# Altium project Pocket Device.PrjPcb
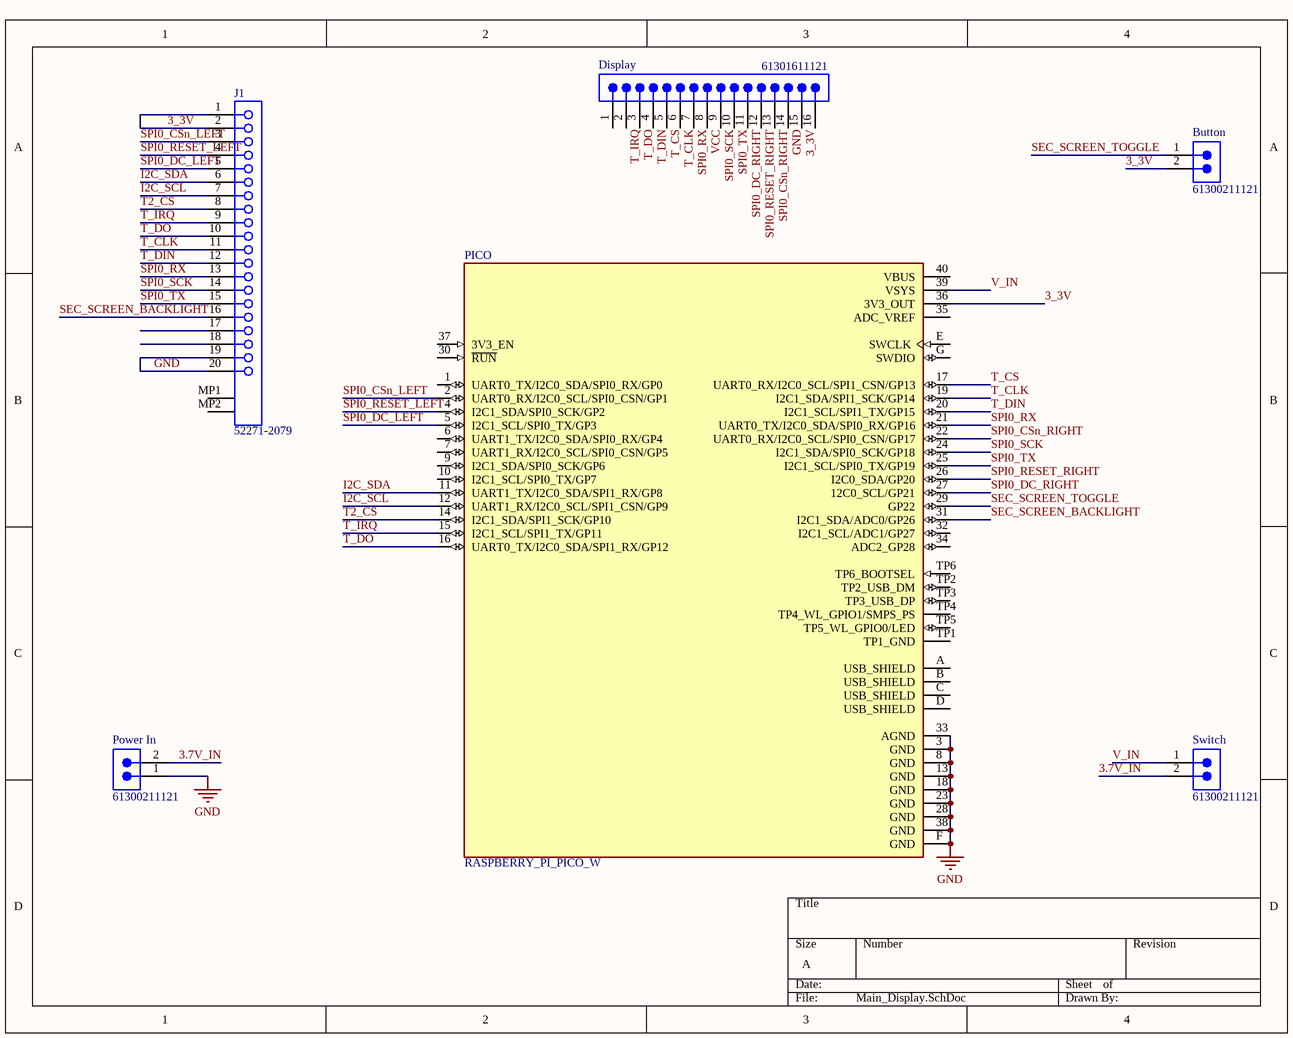
[diagram p0: Main_Display.SchDoc]
2 sheets, 10 parts. Net scope: global (net labels, ports and power ports of the same name join across sheets).
Board files: Pocket Device.PcbDoc, Secondary Display.PcbDoc
Sheets:
  Main_Display.SchDoc
  Secondary_Display.SchDoc

## Sheet Main_Display.SchDoc
size A; SheetNumber: 1; SheetTotal: 2

### Parts
Button  61300211121  [61300211121]
Display  61301611121  [61301611121]
J1  52271-2079  [MOLX-52271-2079]
PICO  RASPBERRY_PI_PICO_W  [MODULE_RASPBERRY_PI_PICO_W]
Power_In  61300211121  [61300211121]
Switch  61300211121  [61300211121]

### Nets
GND: Display.14 J1.19 J1.20 PICO.3(GND) PICO.8(GND) PICO.13(GND) PICO.18(GND) PICO.23(GND) PICO.28(GND) PICO.33(AGND) PICO.38(GND) PICO.F(GND) Power_In.1
3.7V_IN: Power_In.2 Switch.2
3_3V: Button.2 Display.15 J1.1 J1.2 PICO.36(3V3_OUT)
I2C_SCL: J1.7 PICO.12(UART1_RX/I2C0_SCL/SPI1_CSN/GP9)
I2C_SDA: J1.6 PICO.11(UART1_TX/I2C0_SDA/SPI1_RX/GP8)
SEC_SCREEN_BACKLIGHT: J1.16 PICO.31(I2C1_SDA/ADC0/GP26)
SEC_SCREEN_TOGGLE: Button.1 PICO.29(GP22)
SPI0_CSn_LEFT: J1.3 PICO.2(UART0_RX/I2C0_SCL/SPI0_CSN/GP1)
SPI0_CSn_RIGHT: Display.13 PICO.22(UART0_RX/I2C0_SCL/SPI0_CSN/GP17)
SPI0_DC_LEFT: J1.5 PICO.5(I2C1_SCL/SPI0_TX/GP3)
SPI0_DC_RIGHT: Display.11 PICO.27(12C0_SCL/GP21)
SPI0_RESET_LEFT: J1.4 PICO.4(I2C1_SDA/SPI0_SCK/GP2)
SPI0_RESET_RIGHT: Display.12 PICO.26(I2C0_SDA/GP20)
SPI0_RX: Display.7 J1.13 PICO.21(UART0_TX/I2C0_SDA/SPI0_RX/GP16)
SPI0_SCK: Display.9 J1.14 PICO.24(I2C1_SDA/SPI0_SCK/GP18)
SPI0_TX: Display.10 J1.15 PICO.25(I2C1_SCL/SPI0_TX/GP19)
T2_CS: J1.8 PICO.14(I2C1_SDA/SPI1_SCK/GP10)
T_CLK: Display.6 J1.11 PICO.19(I2C1_SDA/SPI1_SCK/GP14)
T_CS: Display.5 PICO.17(UART0_RX/I2C0_SCL/SPI1_CSN/GP13)
T_DIN: Display.4 J1.12 PICO.20(I2C1_SCL/SPI1_TX/GP15)
T_DO: Display.3 J1.10 PICO.16(UART0_TX/I2C0_SDA/SPI1_RX/GP12)
T_IRQ: Display.2 J1.9 PICO.15(I2C1_SCL/SPI1_TX/GP11)
V_IN: PICO.39(VSYS) Switch.1
VCC: Display.8

Not connected (* = marked no-connect by the designer): Display 1 16; J1 17 18 MP1 MP2; PICO 1(UART0_TX/I2C0_SDA/SPI0_RX/GP0) 6(UART1_TX/I2C0_SDA/SPI0_RX/GP4) 7(UART1_RX/I2C0_SCL/SPI0_CSN/GP5) 9(I2C1_SDA/SPI0_SCK/GP6) 10(I2C1_SCL/SPI0_TX/GP7) 30(~{RUN}) 32(I2C1_SCL/ADC1/GP27) 34(ADC2_GP28) 35(ADC_VREF) 37(3V3_EN) 40(VBUS) A(USB_SHIELD) B(USB_SHIELD) C(USB_SHIELD) D(USB_SHIELD) E(SWCLK) G(SWDIO) TP1(TP1_GND) TP2(TP2_USB_DM) TP3(TP3_USB_DP) TP4(TP4_WL_GPIO1/SMPS_PS) TP5(TP5_WL_GPIO0/LED) TP6(TP6_BOOTSEL)

### Library data of the parts
Button Power_In Switch = CMP-1712-00002-6: NexarPartId: 20081794; Number of Contacts: 2; Pitch: 2.54mm; Connector Type: Male Pin; Voltage Rating: 250V; Current Rating: 3A; Gender: Male; Contact Resistance: 20mΩ; Height: 8.94mm; Lead Free: Lead Free; Number of Pins: 2; Termination: Through Hole; RoHS: Compliant; Lead Pitch: 2.54mm; REACH SVHC: No SVHC; Housing Material: PBT; Contact Mating Length: 5.9944mm; Min Operating Temperature: -40°C; Orientation: Vertical; Contact Material: Copper; Contact Gender: Male; Max Operating Temperature: 125°C; Number of Rows: 1; Number of Positions: 2; Packaging: Bulk; Contact Plating: Gold; Mount: Through Hole; Color: Black; Operating Supply Voltage: 250V
Display = CMP-1502-01095-4: NexarPartId: 32855548; Voltage Rating: 250V; Connector Type: Male Pin; Current Rating: 3A; Contact Resistance: 20mΩ; Number of Contacts: 16; Gender: Male; Pitch: 2.54mm; Min Operating Temperature: -40°C; Termination: Solder; Height: 8.89mm; Contact Plating: Gold; Packaging: Bulk; Contact Material: Copper; Mount: Through Hole; Number of Rows: 1; Contact Mating Length: 5.9944mm; Operating Supply Voltage: 250V; RoHS: Compliant; Max Operating Temperature: 105°C; Lead Pitch: 2.54mm; Color: Black; Number of Pins: 16; Number of Positions: 16; REACH SVHC: Unknown; Orientation: Vertical
J1 = CMP-1241-00254-1: 1.0 mm Pitch Easy-On(TM) Type FPC Connector, 3.0 mm Mated Height, Right Angle, ZIF, SMT, Bottom Contact, 20 Circuits, -40 to 85 degC, ELV and RoHS Compliant, Tape and Reel; Manufacturer: Molex; Material - Metal: Phosphor Bronze; Voltage (Max): 50V AC (RMS)/DC; PCB Retention: Yes; Pitch - Termination Interface: 1.00mm; Mated Height: 3.00mm; Circuits (Loaded): 20; Stackable: No; Material - Plating Mating: Tin-Bismuth; Current (Max per Contact): 0.5A; Entry Angle: 90degrees Angle; Durability (mating cycles max): 30; Contact Position: Bottom; ComponentLink1URL: http://www.molex.com/molex/index.jsp; Packing: Tape and Reel; ComponentLink2URL: http://www.molex.com/webdocs/datasheets/pdf/en-us/0522712079_FFC_FPC_CONNECTORS.pdf; PackageVersion: Rev. B, 04/2004; ComponentLink3Description: Package Specification; ComponentLink3URL: http://www.molex.com/pdm_docs/sd/522712079_sd.pdf; Number of Rows: 1; PartNumber: 52271-2079; ComponentLink2Description: Datasheet; PackageDescription: 20-Lead FPC Connector, Pitch 1.0 mm; Mounting Technology: Surface Mount; Polarized to PCB: Yes; PackageReference: 52271-2079; Pitch - Mating Interface: 1.00mm; ComponentLink1Description: Manufacturer URL; Orientation: Right Angle; RoHS: TRUE; PCB Locator: No; Material - Plating Termination: Tin-Bismuth
PICO = RASPBERRY_PI_PICO_W: Raspberry Pi Board, Arm Cortex-M0+; Silicon Manufacturer:Raspberry Pi; No. Of Bits:32Bit; Silicon Family Name:-; Core Architecture:Arm; Core Sub-Architecture:Cortex-M0+; Silicon Core Number:Rp2040; Product Range:Raspberry Pi Pico Rohs Compliant: Yes |Raspberry-Pi RASPBERRY PI PICO W; SnapEDA_Link: https://www.snapeda.com/parts/RASPBERRY%20PI%20PICO%20W/Raspberry+Pi/view-part/?ref=snap; Package: None; Value: *; MF: Raspberry Pi; MP: RASPBERRY PI PICO W; Check_prices: https://www.snapeda.com/parts/RASPBERRY%20PI%20PICO%20W/Raspberry+Pi/view-part/?ref=eda

## Sheet Secondary_Display.SchDoc
size A; SheetNumber: 2; SheetTotal: 2
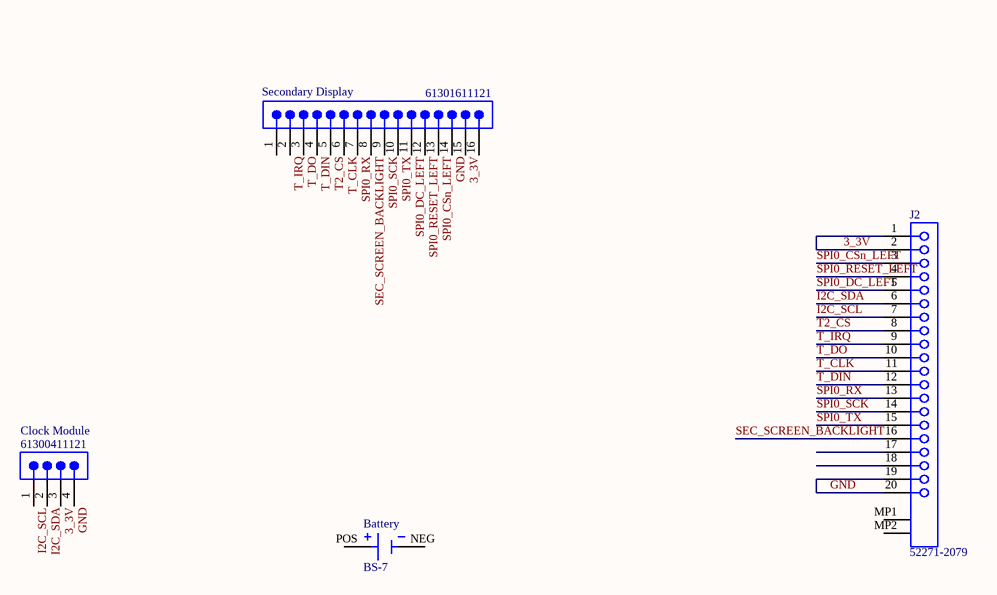
[diagram p1: Secondary_Display.SchDoc]

### Parts
Battery  BS-7  [BAT_BS-7]
Clock_Module  61300411121  [61300411121]
J2  52271-2079  [MOLX-52271-2079]
Secondary_Display  61301611121  [61301611121]

### Nets
GND: Clock_Module.4 J2.19 J2.20 Secondary_Display.14
3_3V: Clock_Module.3 J2.1 J2.2 Secondary_Display.15
I2C_SCL: Clock_Module.1 J2.7
I2C_SDA: Clock_Module.2 J2.6
SEC_SCREEN_BACKLIGHT: J2.16 Secondary_Display.8
SPI0_CSn_LEFT: J2.3 Secondary_Display.13
SPI0_DC_LEFT: J2.5 Secondary_Display.11
SPI0_RESET_LEFT: J2.4 Secondary_Display.12
SPI0_RX: J2.13 Secondary_Display.7
SPI0_SCK: J2.14 Secondary_Display.9
SPI0_TX: J2.15 Secondary_Display.10
T2_CS: J2.8 Secondary_Display.5
T_CLK: J2.11 Secondary_Display.6
T_DIN: J2.12 Secondary_Display.4
T_DO: J2.10 Secondary_Display.3
T_IRQ: J2.9 Secondary_Display.2

Not connected (* = marked no-connect by the designer): Battery NEG POS; J2 17 18 MP1 MP2; Secondary_Display 1 16

### Library data of the parts
Battery = BS-7: Battery Holder (Open) Coin, 20.0mm 1 Cell PC Pin; MF: MPD (Memory; SnapEDA_Link: https://www.snapeda.com/parts/BS-7/MPD+%2528Memory+Protection+Devices%2529/view-part/?ref=snap; Package: None; MP: BS-7; Check_prices: https://www.snapeda.com/parts/BS-7/MPD+%2528Memory+Protection+Devices%2529/view-part/?ref=eda; Purchase-URL: https://pricing.snapeda.com/search/part/BS-7/?ref=eda; Digi-Key_Part_Number: BS-7-ND; Value: *; ComponentLink1Description: https://www.digikey.com/en/products/detail/mpd-memory-protection-devices/BS-7/389447; ComponentLink1URL: *
Clock_Module = CMP-1502-01064-3: NexarPartId: 32855522; Operating Supply Voltage: 250V; Pitch: 2.54mm; Contact Resistance: 20mΩ; Number of Positions: 4; Current Rating: 3A; Connector Type: Male Pin; Gender: Male; Contact Plating: Gold; Height: 8.89mm; Lead Pitch: 2.54mm; Lead Free: Lead Free; Contact Mating Length: 5.9944mm; Number of Rows: 1; Termination: Solder; Packaging: Bulk; REACH SVHC: Unknown; Min Operating Temperature: -40°C; RoHS: Compliant; Number of Contacts: 4; Voltage Rating: 250V; Color: Black; Max Operating Temperature: 105°C; Contact Material: Copper; Mount: Through Hole; Orientation: Vertical; Number of Pins: 4
J2 = CMP-1241-00254-1: as J1 on sheet Main_Display; Contact Position: Bottom; ComponentLink1URL: http://www.molex.com/molex/index.jsp; Packing: Tape and Reel; ComponentLink2URL: http://www.molex.com/webdocs/datasheets/pdf/en-us/0522712079_FFC_FPC_CONNECTORS.pdf; PackageVersion: Rev. B, 04/2004; ComponentLink3Description: Package Specification; ComponentLink3URL: http://www.molex.com/pdm_docs/sd/522712079_sd.pdf; Number of Rows: 1; PartNumber: 52271-2079; ComponentLink2Description: Datasheet; PackageDescription: 20-Lead FPC Connector, Pitch 1.0 mm; Mounting Technology: Surface Mount; Polarized to PCB: Yes; PackageReference: 52271-2079; Pitch - Mating Interface: 1.00mm; ComponentLink1Description: Manufacturer URL; Orientation: Right Angle; RoHS: TRUE; PCB Locator: No; Material - Plating Termination: Tin-Bismuth
Secondary_Display = CMP-1502-01095-4: as Display on sheet Main_Display; Min Operating Temperature: -40°C; Termination: Solder; Height: 8.89mm; Contact Plating: Gold; Packaging: Bulk; Contact Material: Copper; Mount: Through Hole; Number of Rows: 1; Contact Mating Length: 5.9944mm; Operating Supply Voltage: 250V; RoHS: Compliant; Max Operating Temperature: 105°C; Lead Pitch: 2.54mm; Color: Black; Number of Pins: 16; Number of Positions: 16; REACH SVHC: Unknown; Orientation: Vertical

## Nets that join several sheets
GND: Main_Display (13 pins), Secondary_Display (Clock_Module.4 J2.19 J2.20 Secondary_Display.14)
3_3V: Main_Display (5 pins), Secondary_Display (Clock_Module.3 J2.1 J2.2 Secondary_Display.15)
I2C_SCL: Main_Display (J1.7 PICO.12), Secondary_Display (Clock_Module.1 J2.7)
I2C_SDA: Main_Display (J1.6 PICO.11), Secondary_Display (Clock_Module.2 J2.6)
SEC_SCREEN_BACKLIGHT: Main_Display (J1.16 PICO.31), Secondary_Display (J2.16 Secondary_Display.8)
SPI0_CSn_LEFT: Main_Display (J1.3 PICO.2), Secondary_Display (J2.3 Secondary_Display.13)
SPI0_DC_LEFT: Main_Display (J1.5 PICO.5), Secondary_Display (J2.5 Secondary_Display.11)
SPI0_RESET_LEFT: Main_Display (J1.4 PICO.4), Secondary_Display (J2.4 Secondary_Display.12)
SPI0_RX: Main_Display (Display.7 J1.13 PICO.21), Secondary_Display (J2.13 Secondary_Display.7)
SPI0_SCK: Main_Display (Display.9 J1.14 PICO.24), Secondary_Display (J2.14 Secondary_Display.9)
SPI0_TX: Main_Display (Display.10 J1.15 PICO.25), Secondary_Display (J2.15 Secondary_Display.10)
T2_CS: Main_Display (J1.8 PICO.14), Secondary_Display (J2.8 Secondary_Display.5)
T_CLK: Main_Display (Display.6 J1.11 PICO.19), Secondary_Display (J2.11 Secondary_Display.6)
T_DIN: Main_Display (Display.4 J1.12 PICO.20), Secondary_Display (J2.12 Secondary_Display.4)
T_DO: Main_Display (Display.3 J1.10 PICO.16), Secondary_Display (J2.10 Secondary_Display.3)
T_IRQ: Main_Display (Display.2 J1.9 PICO.15), Secondary_Display (J2.9 Secondary_Display.2)